# EAGLE schematic newday_alt_v0001 (EAGLE 7.2.0)

## Sheet 1 of 2: Power Input
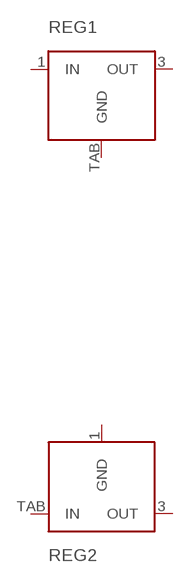
[diagram p0: schematic, sheet 1]

### Parts
REG1  MC7812  [D2PAK]
REG2  MC7912  [D2PAK]
Unconnected: REG1.1(IN) REG1.3(OUT) REG1.TAB(GND) REG2.1(GND) REG2.3(OUT) REG2.TAB(IN)

## Sheet 2 of 2: Amplifier
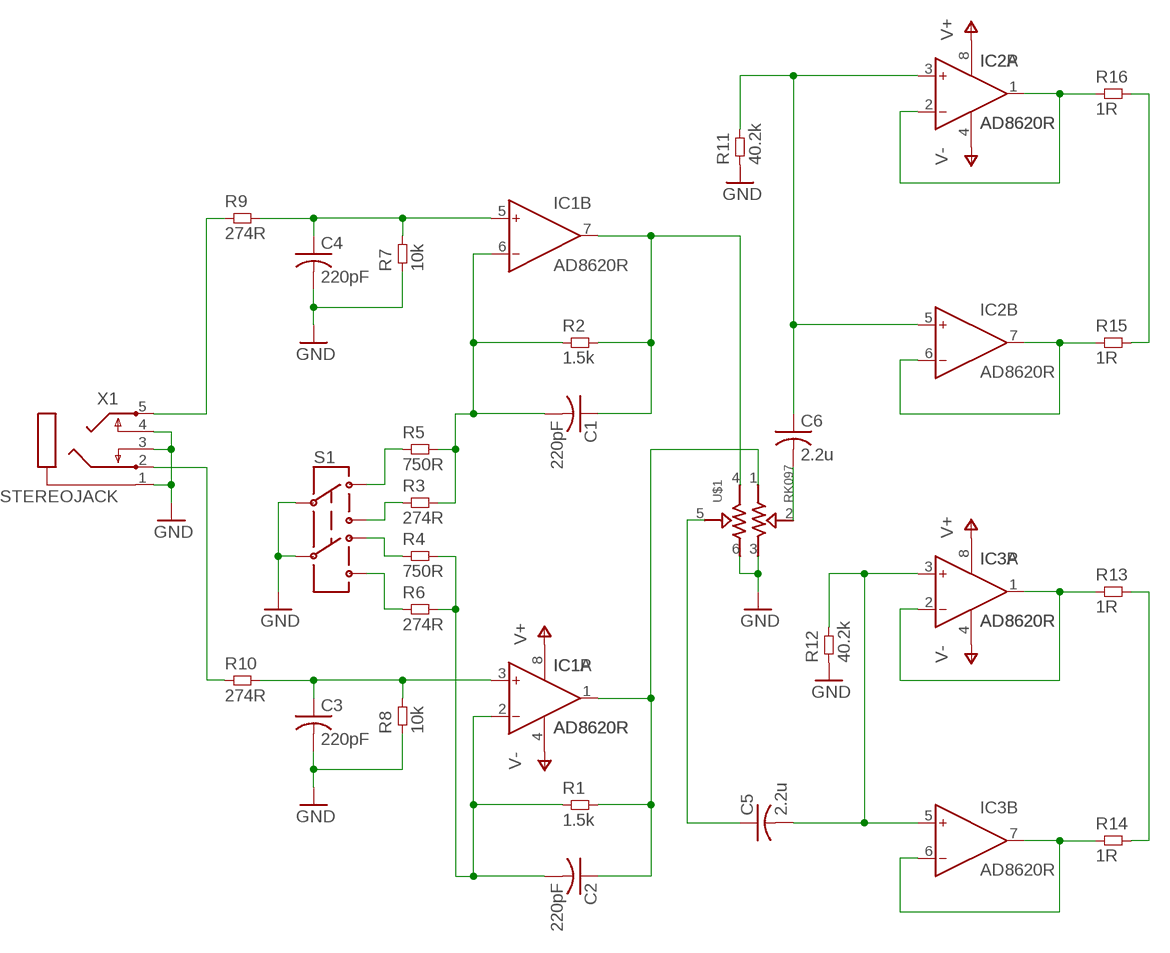
[diagram p1: schematic, sheet 2]

### Parts
C1  220pF  C-US025-040X050  [C025-040X050]
C2  220pF  C-US025-040X050  [C025-040X050]
C3  220pF  C-US025-040X050  [C025-040X050]
C4  220pF  C-US025-040X050  [C025-040X050]
C5  2.2u  C-US050-075X075  [C050-075X075]
C6  2.2u  C-US050-075X075  [C050-075X075]
IC1  AD8620R  [SO8]
IC2  AD8620R  [SO8]
IC3  AD8620R  [SO8]
R1  1.5k  RES0603L3  [0603L3]
R2  1.5k  RES0603L3  [0603L3]
R3  274R  RES0603L3  [0603L3]
R4  750R  RES0603L3  [0603L3]
R5  750R  RES0603L3  [0603L3]
R6  274R  RES0603L3  [0603L3]
R7  10k  RES0603L3  [0603L3]
R8  10k  RES0603L3  [0603L3]
R9  274R  RES0603L3  [0603L3]
R10  274R  RES0603L3  [0603L3]
R11  40.2k  RES0603L3  [0603L3]
R12  40.2k  RES0603L3  [0603L3]
R13  1R  RES1210L3  [1210L3]
R14  1R  RES1210L3  [1210L3]
R15  1R  RES1210L3  [1210L3]
R16  1R  RES1210L3  [1210L3]
S1  SWITCH-DPDTOS  [OS]
U$1  RK097  [RK097]
X1  STEREOJACK  [STX3100]

### Nets
GND: C3.2 C4.2 R7.P$1 R8.P$1 R11.P$1 R12.P$1 S1.2 S1.5 U$1.3 U$1.6 X1.1 X1.3 X1.4
N$1: C1.1 IC1.7(B:OUT) R2.P$2 U$1.4
N$2: C2.1 IC1.1(A:OUT) R1.P$2 U$1.1
N$3: C1.2 IC1.6(B:IN-) R2.P$1 R3.P$2 R5.P$2
N$4: C2.2 IC1.2(A:IN-) R1.P$1 R4.P$2 R6.P$2
N$5: R5.P$1 S1.1
N$6: R3.P$1 S1.3
N$7: R6.P$1 S1.6
N$8: R4.P$1 S1.4
N$9: C6.2 U$1.2
N$10: C6.1 IC2.3(A:IN+) IC2.5(B:IN+) R11.P$2
N$11: C5.1 U$1.5
N$12: C4.1 IC1.5(B:IN+) R7.P$2 R9.P$2
N$13: C3.1 IC1.3(A:IN+) R8.P$2 R10.P$2
N$14: C5.2 IC3.3(A:IN+) IC3.5(B:IN+) R12.P$2
N$15: IC2.6(B:IN-) IC2.7(B:OUT) R15.P$1
N$16: IC2.1(A:OUT) IC2.2(A:IN-) R16.P$1
N$17: IC3.1(A:OUT) IC3.2(A:IN-) R13.P$1
N$18: IC3.6(B:IN-) IC3.7(B:OUT) R14.P$1
N$19: R15.P$2 R16.P$2
N$20: R13.P$2 R14.P$2
N$21: R9.P$1 X1.5
N$22: R10.P$1 X1.2
V+: IC1.8(P:V+) IC2.8(P:V+) IC3.8(P:V+)
V-: IC1.4(P:V-) IC2.4(P:V-) IC3.4(P:V-)

## Library data of the parts
C1-C6 = rcl:C-US: CAPACITOR, American symbol
IC1-IC3 = analog-devices:AD8620: Precision, Very Low Noise, Low Input Bias Current, Wide Bandwidth JFET Operational Amplifiers Source: http://www.analog.com/static/imported-files/data_sheets/AD8610_8620.pdf; MF: ALTERA CORPORATION; MPN: AD8620ARZ; OC_FARNELL: 9994386; OC_NEWARK: 59K6972
R1-R16 = common:RES
REG1 = common:MC7812
REG2 = common:MC7912
S1 = SparkFun-Electromechanical:SWITCH-DPDT: DPDT Version of the COM-00597
U$1 = SparkFun-Electromechanical:RK097
X1 = adafruit:STEREOJACK: MIC/HEADPHONE JACK Stereo jack with two switches. Kycon STX3100, CUI SJ1-3555NG and/or 4UCon 05544